# Altium schematic sheet 01.Template.Main.SchDoc
size 209 x 297 mm; Author: Мурашкин Д.В.; DocumentNumber: _D01.R1; SheetNumber: 2; SheetTotal: 7; Scale: 1:1; Letter1Column: Э; PartName: Блок схема
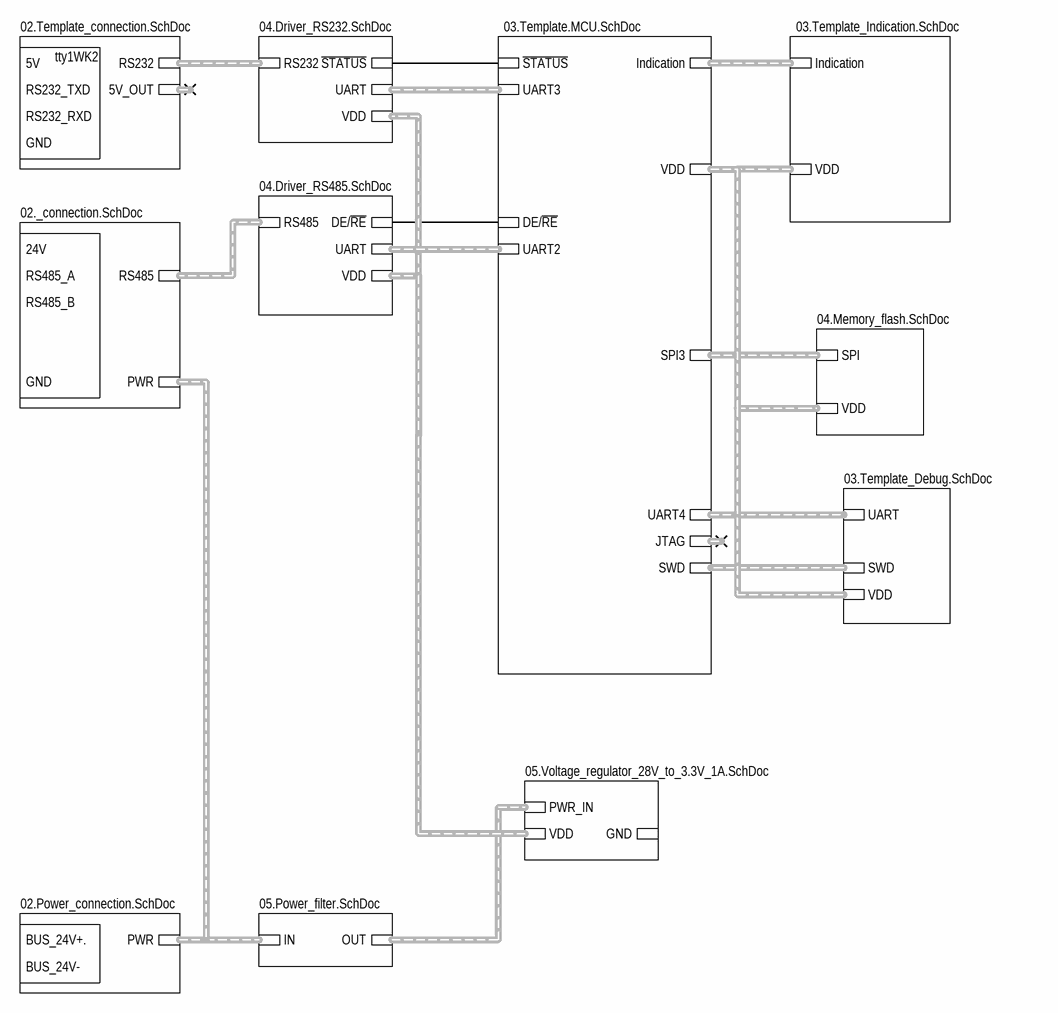
[diagram p0: 01.Template.Main.SchDoc]

## Sub-sheets
_connection = 02._connection.SchDoc: RS485 (harness RS485), PWR (harness PWR)
Debug = 03.Template_Debug.SchDoc: SWD (harness SWD), VDD (harness VDD), UART
Driver_RS232 = 04.Driver_RS232.SchDoc: UART (harness UART), RS232 (harness RS232), VDD (harness VDD), ~{STATUS}
Driver_RS485 = 04.Driver_RS485.SchDoc: RS485 (harness RS485), DE/~{RE}, VDD (harness VDD), UART (harness UART)
Indication = 03.Template_Indication.SchDoc: Indication (harness Indication), VDD (harness VDD)
MCU = 03.Template.MCU.SchDoc: VDD (harness VDD), Indication (harness Indication), UART3 (harness UART), UART2 (harness UART), JTAG (harness JTAG), SWD (harness SWD), SPI3 (harness SPI), DE/~{RE}, ~{STATUS}, UART4 (harness UART)
Memory_flash_MB = 04.Memory_flash.SchDoc: SPI (harness SPI), VDD (harness VDD)
Power_connection = 02.Power_connection.SchDoc: PWR (harness PWR)
Power_filter = 05.Power_filter.SchDoc: OUT (harness PWR), IN (harness PWR)
Template_connection = 02.Template_connection.SchDoc: RS232 (harness RS232), 5V_OUT (harness 5V)
VR_3.3V_1A = 05.Voltage_regulator_28V_to_3.3V_1A.SchDoc: VDD (harness VDD), PWR_IN (harness PWR), GND

## Nets
(unnamed): sheet MCU/DE/~{RE}, sheet Driver_RS485/DE/~{RE}
(unnamed): sheet MCU/~{STATUS}, sheet Driver_RS232/~{STATUS}

## Buses and harness runs
harness sheet _connection/PWR = sheet Power_connection/PWR = sheet Power_filter/IN
harness sheet _connection/RS485 = sheet Driver_RS485/RS485
harness sheet Debug/SWD = sheet MCU/SWD
harness sheet Debug/UART = sheet MCU/UART4
harness sheet Debug/VDD = sheet Indication/VDD = sheet MCU/VDD = sheet Memory_flash_MB/VDD
harness sheet Driver_RS232/RS232 = sheet Template_connection/RS232
harness sheet Driver_RS232/UART = sheet MCU/UART3
harness sheet Driver_RS232/VDD = sheet Driver_RS485/VDD = sheet VR_3.3V_1A/VDD
harness sheet Driver_RS485/UART = sheet MCU/UART2
harness sheet Indication/Indication = sheet MCU/Indication
harness sheet MCU/SPI3 = sheet Memory_flash_MB/SPI
harness sheet Power_filter/OUT = sheet VR_3.3V_1A/PWR_IN

## Notes on the sheet
- 5V
- RS232_TXD
- tty1WK2
- RS232_RXD
- GND
- 24V
- RS485_A
- RS485_B
- BUS_24V+.
- BUS_24V-
- Подп. и дата
- Инв. № дубл.
- Взам. инв. №
- Инв. № подл.
- Изм.
- Лист
- № докум.
- Подп.
- Дата
- 2.106-A4
- Копировал
- Формат А4